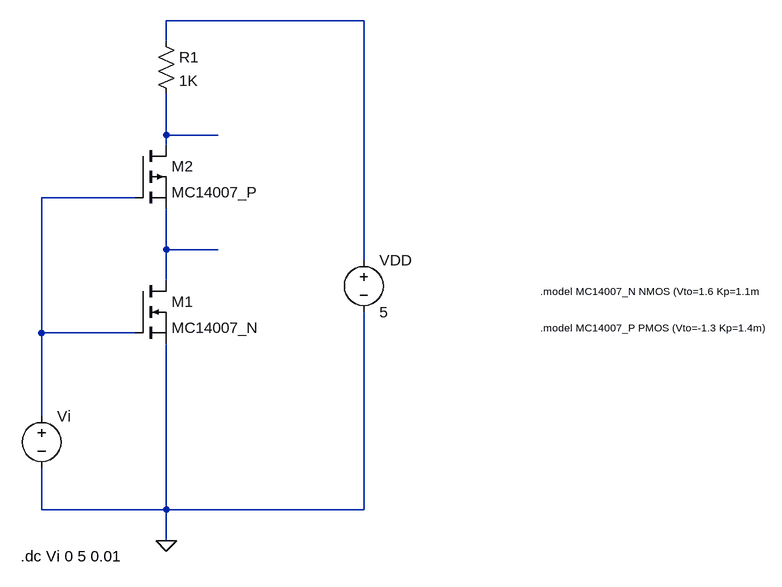
[diagram p0: schematic 1.3.1.asc]
1.3.1.asc, the LTspice schematic file:
Version 4
SHEET 1 880 680
WIRE -128 -432 -432 -432
WIRE -432 -400 -432 -432
WIRE -432 -256 -432 -320
WIRE -352 -256 -432 -256
WIRE -432 -240 -432 -256
WIRE -480 -160 -624 -160
WIRE -432 -80 -432 -144
WIRE -352 -80 -432 -80
WIRE -128 -64 -128 -432
WIRE -432 -32 -432 -80
WIRE -624 48 -624 -160
WIRE -480 48 -624 48
WIRE -624 176 -624 48
WIRE -624 320 -624 256
WIRE -432 320 -432 64
WIRE -432 320 -624 320
WIRE -128 320 -128 16
WIRE -128 320 -432 320
WIRE -432 368 -432 320
FLAG -432 368 0
SYMBOL nmos -480 -32 R0
SYMATTR InstName M1
SYMATTR Value MC14007_N
SYMBOL voltage -128 -80 R0
SYMATTR InstName VDD
SYMATTR Value 5
SYMBOL voltage -624 160 R0
WINDOW 3 24 44 Left 2
WINDOW 123 0 0 Left 0
WINDOW 39 0 0 Left 0
SYMATTR Value ""
SYMATTR InstName Vi
SYMBOL pmos -480 -240 R0
SYMATTR InstName M2
SYMATTR Value MC14007_P
SYMBOL res -448 -416 R0
SYMATTR InstName R1
SYMATTR Value 1K
TEXT 144 -16 Left 1 !.model MC14007_N NMOS (Vto=1.6 Kp=1.1m
TEXT 144 40 Left 1 !.model MC14007_P PMOS (Vto=-1.3 Kp=1.4m)
TEXT -656 392 Left 2 !.dc Vi 0 5 0.01

The netlist it stands for:
* 1.3.1.asc
M1 N004 N003 0 0 MC14007_N
VDD N001 0 5
Vi N003 0
M2 N002 N003 N004 N004 MC14007_P
R1 N001 N002 1K
.model NMOS NMOS
.model PMOS PMOS
.lib standard.mos
.model MC14007_N NMOS (Vto=1.6 Kp=1.1m
.model MC14007_P PMOS (Vto=-1.3 Kp=1.4m)
.dc Vi 0 5 0.01
.backanno
.end